# EAGLE schematic persimmon_circle (EAGLE 9.6.2)
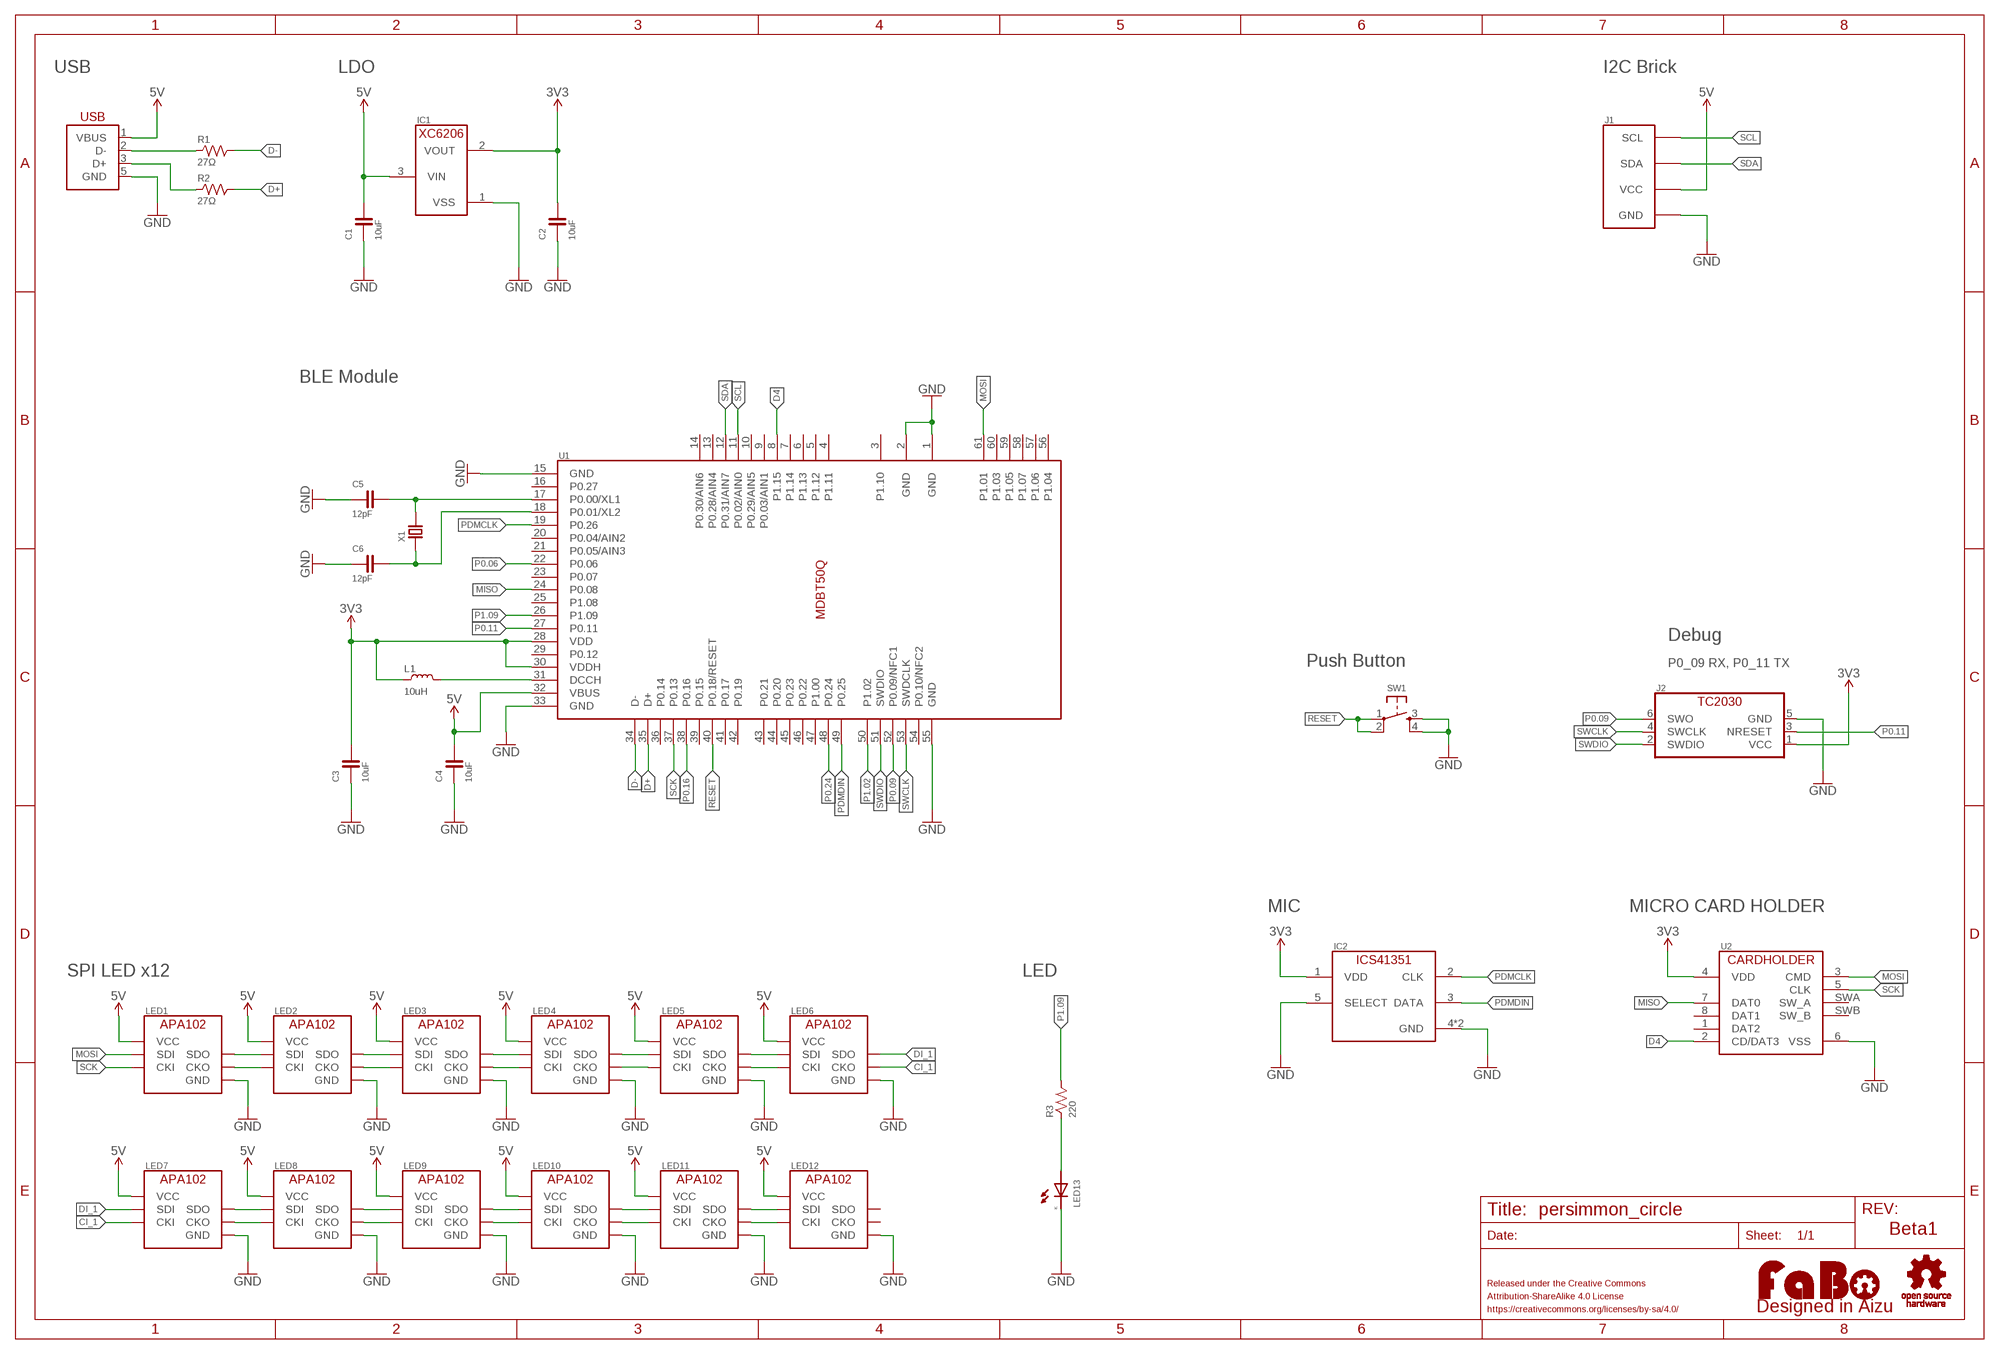
[diagram p0: schematic, sheet 1]

## Parts
C1  10uF  CAPACITOR-0603  [0603]
C2  10uF  CAPACITOR-0603  [0603]
C3  10uF  CAPACITOR-0603  [0603]
C4  10uF  CAPACITOR-0603  [0603]
C5  12pF  CAPACITOR-0603  [0603]
C6  12pF  CAPACITOR-0603  [0603]
IC1  XC6206  [SOT-23]
IC2  TDK-ICS41351  [ICS41351]
J1  FABO_BRICK_I2C-B04B-PASK-1  [FABO_BRICK_I2C_B04B-PASK-1]
J2  TC2030-IDC-NL  [TC2030-IDC-NL]
L1  10uH  COIL-0603  [0603]
LED1  APA102_IPIXEL  [APA102_2020]
LED2  APA102_IPIXEL  [APA102_2020]
LED3  APA102_IPIXEL  [APA102_2020]
LED4  APA102_IPIXEL  [APA102_2020]
LED5  APA102_IPIXEL  [APA102_2020]
LED6  APA102_IPIXEL  [APA102_2020]
LED7  APA102_IPIXEL  [APA102_2020]
LED8  APA102_IPIXEL  [APA102_2020]
LED9  APA102_IPIXEL  [APA102_2020]
LED10  APA102_IPIXEL  [APA102_2020]
LED11  APA102_IPIXEL  [APA102_2020]
LED12  APA102_IPIXEL  [APA102_2020]
LED13  LED-0603  [0603]
LOGO1  LOGO_OSHW-M_BOTTOM  [LOGO_OSHW_M_BOTTOM]
LOGO2  LOGO_FABO-M  [LOGO_FABO_M]
R1  27Ω  RESISTOR-0603  [0603]
R2  27Ω  RESISTOR-0603  [0603]
R3  220  RESISTOR-0603  [0603]
SW1  TACT-SWITCH-SMD_KMR2  [KMR2]
U1  MDBT50  [MDBT50]
U2  CARDHOLDER_MICRO  [DM3AT-SF-PEJM5]
USB1  USB-ZX62D-B-5PA8  [ZX62D-B-5PA8]
X1  CRYSTAL-ABS07  [ABRACON-ABS07-32.768KHZ]

## Nets
3V3: C2.2 C3.2 IC1.2(VOUT) IC2.1(VDD) J2.1(VCC) L1.1 U1.28(VDD) U1.30(VDDH) U2.4(VDD)
5V: C1.2 C4.2 IC1.3(VIN) J1.VCC LED1.VCC LED2.VCC LED3.VCC LED4.VCC LED5.VCC LED6.VCC LED7.VCC LED8.VCC LED9.VCC LED10.VCC LED11.VCC LED12.VCC U1.32(VBUS) USB1.1(VBUS)
CI_1: LED6.CKO LED7.CKI
D4: U1.8(P1.15) U2.2(CD/DAT3)
D+: R2.2 U1.35(D+)
D-: R1.2 U1.34(D-)
DI_1: LED6.SDO LED7.SDI
GND: C1.1 C2.1 C3.1 C4.1 C5.1 C6.1 IC1.1(VSS) IC2.4(GND) IC2.5(SELECT) IC2.6(GND) J1.GND J2.5(GND) LED1.GND LED2.GND LED3.GND LED4.GND LED5.GND LED6.GND LED7.GND LED8.GND LED9.GND LED10.GND LED11.GND LED12.GND LED13.CATHODE SW1.3 SW1.4 U1.1(GND) U1.2(GND) U1.15(GND) U1.33(GND) U1.55(GND) U2.6(VSS) USB1.5(GND)
MISO: U1.24(P0.08) U2.7(DAT0)
MOSI: LED1.SDI U1.61(P1.01) U2.3(CMD)
N$1: R1.1 USB1.2(D-)
N$2: R2.1 USB1.3(D+)
N$3: C6.2 U1.18(P0.01/XL2) X1.P$1
N$4: C5.2 U1.17(P0.00/XL1) X1.P$2
N$5: L1.2 U1.31(DCCH)
N$6: LED13.ANODE R3.1
N$9: LED1.SDO LED2.SDI
N$10: LED1.CKO LED2.CKI
N$11: LED2.SDO LED3.SDI
N$12: LED2.CKO LED3.CKI
N$13: LED3.SDO LED4.SDI
N$14: LED3.CKO LED4.CKI
N$15: LED4.SDO LED5.SDI
N$16: LED4.CKO LED5.CKI
N$17: LED5.SDO LED6.SDI
N$18: LED5.CKO LED6.CKI
N$19: LED7.SDO LED8.SDI
N$20: LED7.CKO LED8.CKI
N$21: LED8.SDO LED9.SDI
N$22: LED8.CKO LED9.CKI
N$23: LED9.SDO LED10.SDI
N$24: LED9.CKO LED10.CKI
N$25: LED10.SDO LED11.SDI
N$26: LED10.CKO LED11.CKI
N$27: LED11.SDO LED12.SDI
N$28: LED11.CKO LED12.CKI
P0.06: U1.22(P0.06)
P0.09: J2.6(SWO) U1.52(P0.09/NFC1)
P0.11: J2.3(NRESET) U1.27(P0.11)
P0.16: U1.38(P0.16)
P0.24: U1.48(P0.24)
P1.02: U1.50(P1.02)
P1.09: R3.2 U1.26(P1.09)
PDMCLK: IC2.2(CLK) U1.19(P0.26)
PDMDIN: IC2.3(DATA) U1.49(P0.25)
RESET: SW1.1 SW1.2 U1.40(P0.18/RESET)
SCK: LED1.CKI U1.37(P0.13) U2.5(CLK)
SCL: J1.SCL U1.11(P0.02/AIN0)
SDA: J1.SDA U1.12(P0.31/AIN7)
SWCLK: J2.4(SWCLK) U1.53(SWDCLK)
SWDIO: J2.2(SWDIO) U1.51(SWDIO)
Unconnected: LED12.CKO LED12.SDO U1.3(P1.10) U1.4(P1.11) U1.5(P1.12) U1.6(P1.13) U1.7(P1.14) U1.9(P0.03/AIN1) U1.10(P0.29/AIN5) U1.13(P0.28/AIN4) U1.14(P0.30/AIN6) U1.16(P0.27) U1.20(P0.04/AIN2) U1.21(P0.05/AIN3) U1.23(P0.07) U1.25(P1.08) U1.29(P0.12) U1.36(P0.14) U1.39(P0.15) U1.41(P0.17) U1.42(P0.19) U1.43(P0.21) U1.44(P0.20) U1.45(P0.23) U1.46(P0.22) U1.47(P1.00) U1.54(P0.10/NFC2) U1.56(P1.04) U1.57(P1.06) U1.58(P1.07) U1.59(P1.05) U1.60(P1.03) U2.1(DAT2) U2.8(DAT1) U2.SWA(SW_A) U2.SWB(SW_B)

## Notes on the sheet
- USB | LDO | I2C Brick
- BLE Module
- Debug
- Push Button | P0_09 RX, P0_11 TX
- MIC | MICRO CARD HOLDER
- SPI LED x12 | LED
- Beta1

## Library data of the parts
C1-C6 = FaBo-Capacitor:CAPACITOR: CAPACITOR
IC1 = FaBo-VoltageRegulator:XC6206
IC2 = FaBo-Sound:TDK-ICS41351
J1 = FaBo-Template:FABO_BRICK_I2C: FaBo Brick I2C
J2 = FaBo-Debbuger:TC2030-IDC
L1 = FaBo-Coil:COIL: RESISTOR
LED1-LED12 = FaBo-LED:APA102
LED13 = FaBo-LED:LED
LOGO1 = FaBo-Logo:LOGO_OSHW
LOGO2 = FaBo-Logo:LOGO_FABO
R1-R3 = FaBo-Resistors:RESISTOR: RESISTOR
SW1 = FaBo-Switch:TACT-SWITCH: Part No Maker Datasheet Distributor 1273HA-160G-G SWITRONIC Catalog <http://www.switronic.com/uploads/images/A10.gif> Akizuki <http://akizukidenshi.com/catalog/g/gP-02561/> DTS-6-V Cosland DTS 6 Series <http://www.cosland.com/newproduct/DTS%20SERIES.pdf> Akizuki <http://akizukidenshi.com/catalog/g/gP-03647/> KMR2 C&K KMR2 SERIES <https://www.ckswitches.com/products/switches/product-details/Tactile/KMR2/> Octoparts Result <https://octopart.com/search?q=KMR2&start=0> TSHA-T-XB2-19E TOP UP INDUSTORY TSHA-T <http://www.top-up.com.tw/front/bin/ptdetail.phtml?Part=TSHA-T> Akizuki <http://akizukidenshi.com/catalog/g/gP-09361/>
U1 = MDBT50Q_171031:MDBT50: Raytac Corporation MDBT50 Bluetooth Low Energy Module based on Noridc nRF52840 Source: Raytac datasheet
U2 = FaBo-SD:CARDHOLDER_MICRO
USB1 = FaBo-USB:USB: Parts No Maker Datasheet Distributor B05B-PASK-1 JST Datasheet <http://www.jst-mfg.com/product/pdf/eng/ePA-F.pdf> Octoparts Result <https://octopart.com/search?q=B05B-PASK-1> DX4R005JJ2R1800 JAE Datasheet <https://www.jae.com/z-jp/product_jp.cfm?l_code=JA&series_code=DX4&product_number=DX4R005JJ2R1800> Octoparts Result <https://octopart.com/dx4r005jj2r1800-jae+electronics-22232443> S04B-PASK-2 JST Web <http://www.jst-mfg.com/product/detail.php?series=189> Octoparts Result <https://octopart.com/search?q=S04B-PASK-2&start=0> USB-4AF103BS Useconn Electronics Datasheet <http://akizukidenshi.com/download/ds/useconn/USB-4AF103BS-Rev_C.PDF> Akizuki <http://akizukidenshi.com/catalog/g/gC-11551/> USB-A-4P-MALE(1734028-1) TE Web <http://www.te.com/jpn-ja/product-1734028-1.html> Octopart Result <https://octopart.com/1734028-1-te+connectivity-40535237> USB2-AF-WTP-CS-QRFL VPI Datasheet <https://www.vpi.us/dpdf/70/usb2-af-wtp-cs-qrfl.pdf> VPI Store <https://www.vpi.us/usba-waterproof/waterproof-usb-typeb-qrfl-357> ZX62R-B-5P VPI Web <https://www.hirose.com/product/jp/products/ZX/ZX62R-B-5P(30)/> Octopart Result <https://octopart.com/zx62d-b-5p8%2830%29-hirose-70111550>
X1 = FaBo-Crystal:CRYSTAL

## Net classes
2 gnd: width 0.254 mm, drill 0.61 mm, clearance 0.254 mm
3 usbvcc: width 0.254 mm, drill 0.61 mm, clearance 0.254 mm
4 aref: width 0.254 mm, drill 0.61 mm, clearance 0.254 mm